# EasyEDA schematic SCH_XH-M401_8A_2022-11-25.json
TITLE: XH-M401; REV: 1.0; Date: Zibbi; Sheet: 1/1; Drawn By: Zibbi
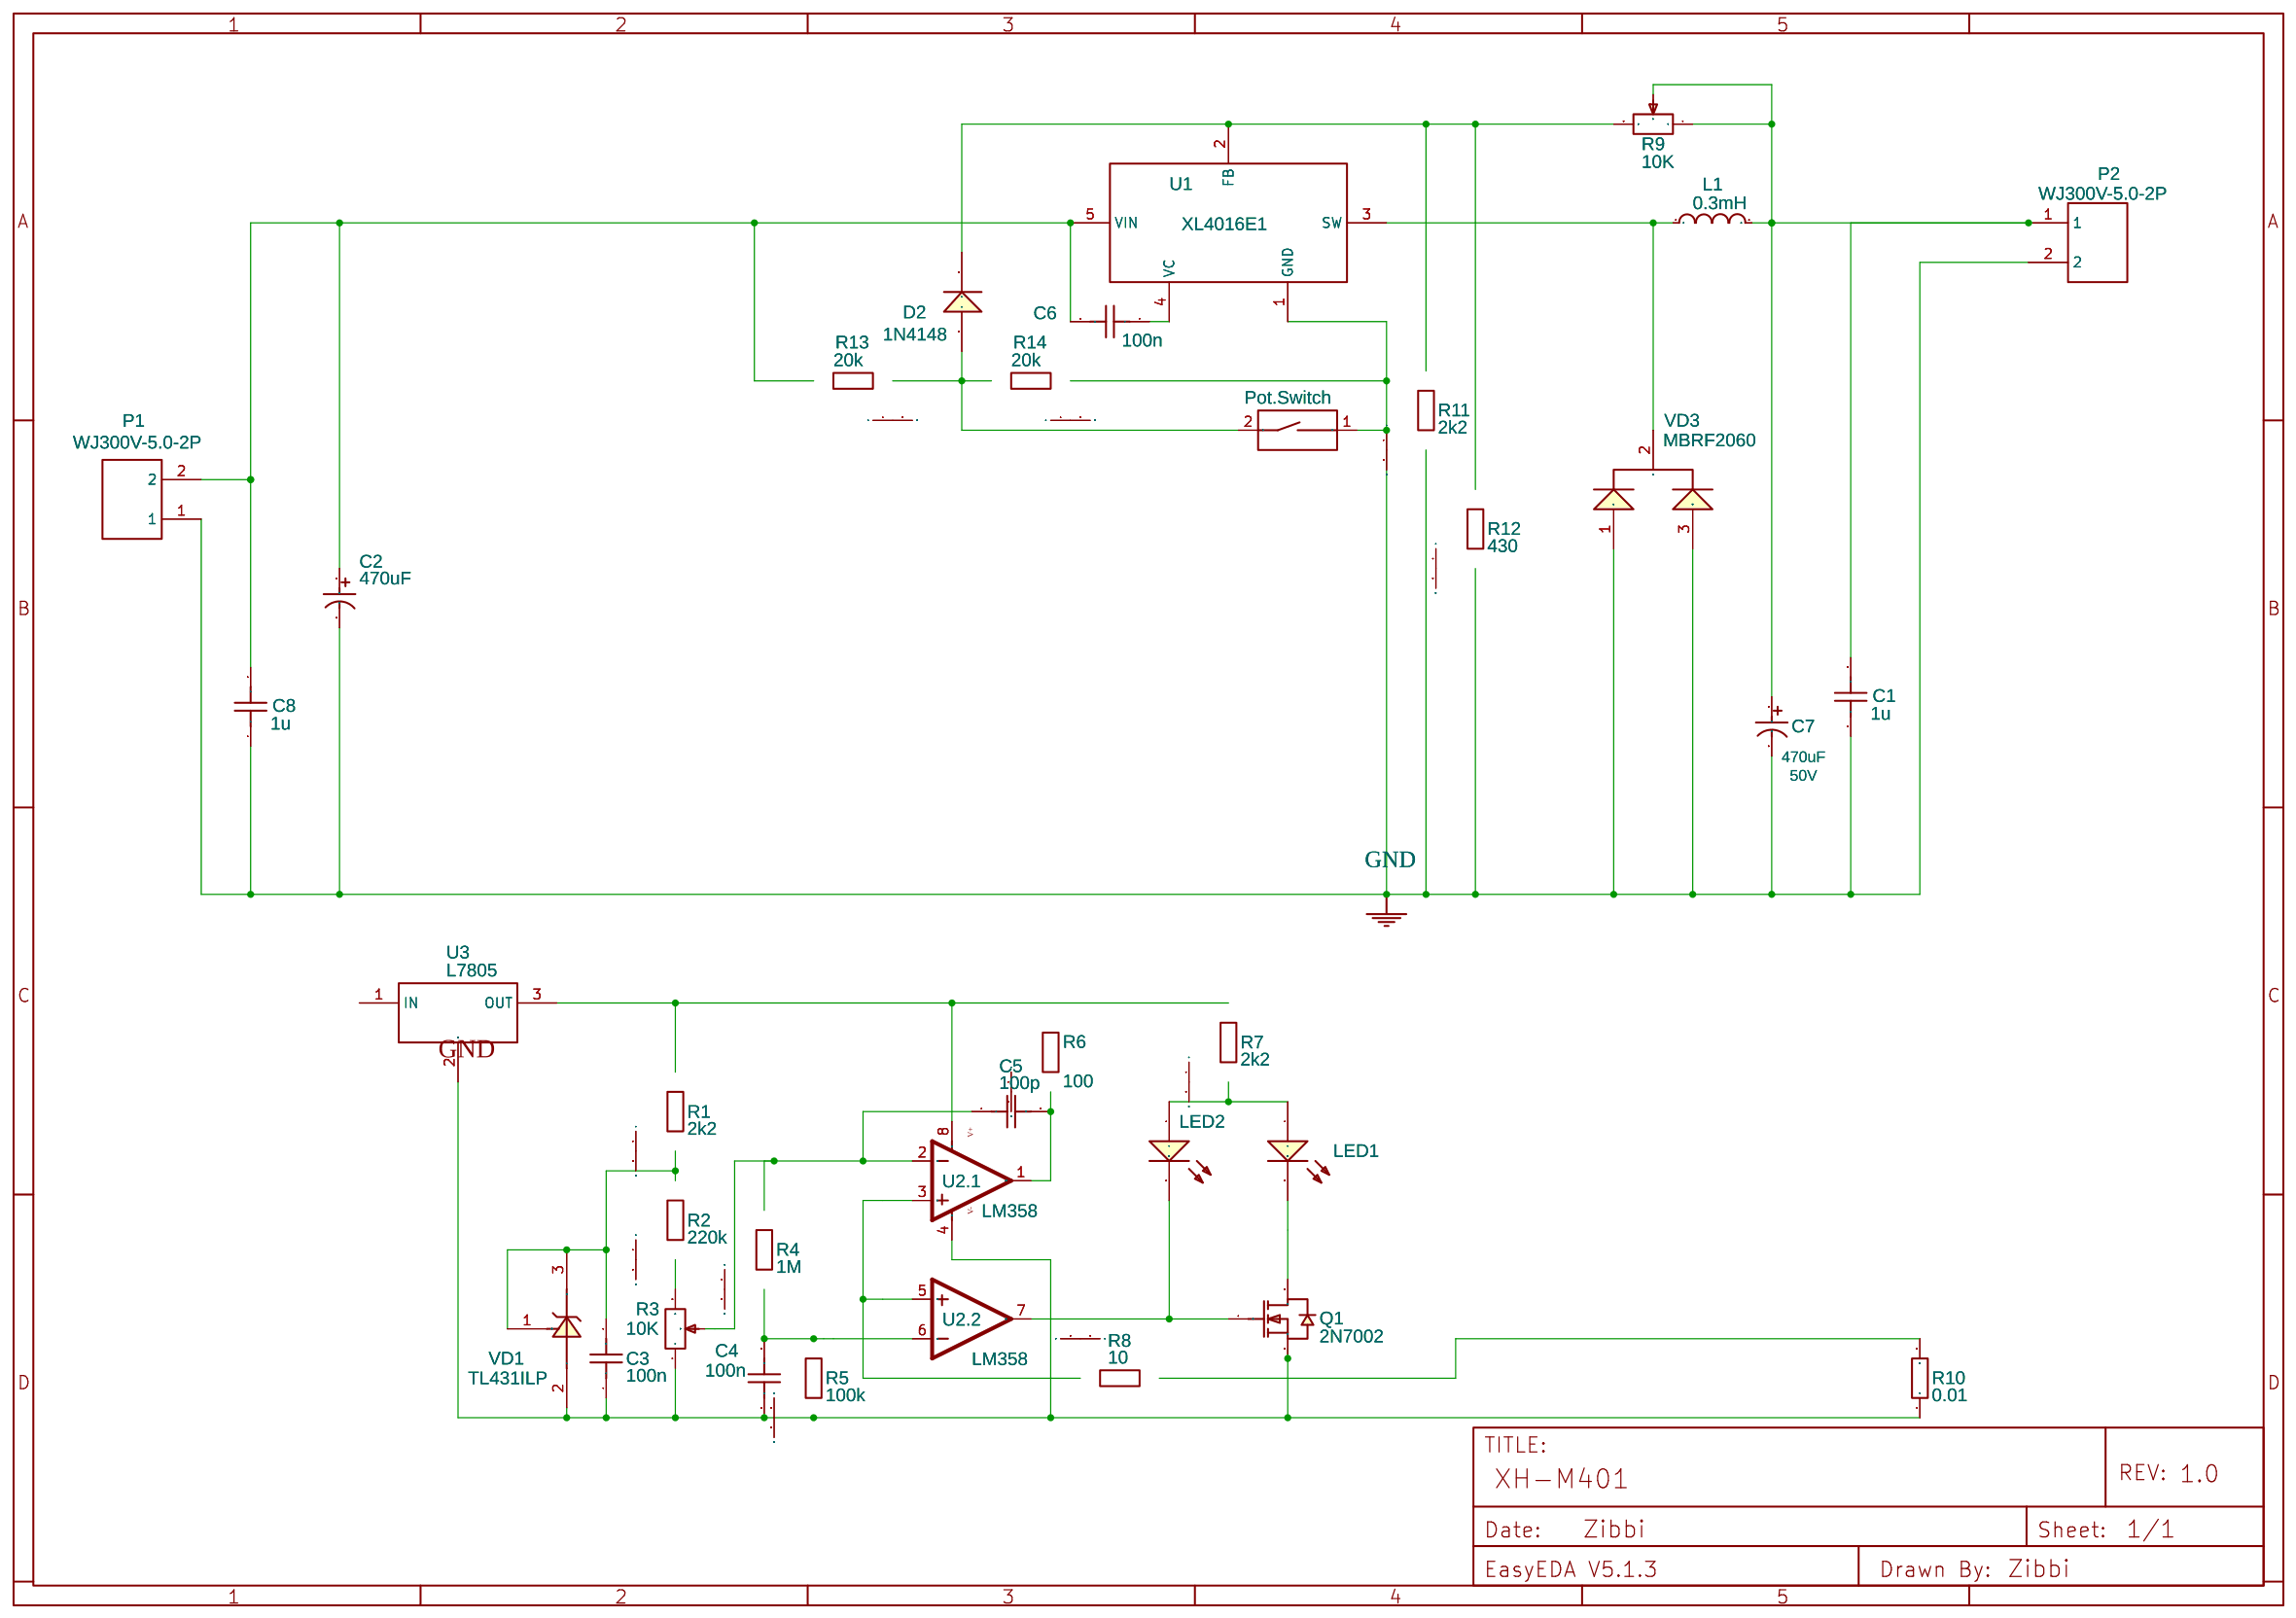
[diagram p0: schematic sheet]

## Parts
C1  1u  [RAD-0.1]
C2  470uF  [CAP-D10.0XF5.0]
C3  100n  [RAD-0.1]
C4  100n  [RAD-0.1]
C5  100p  [RAD-0.1]
C6  100n  [RAD-0.1]
C7  470uF\n50V  [CAP-D12.5XF5.0]
C8  1u  [RAD-0.1]
D2  1N4148  [DO-35]
L1  0.3mH  [AXIAL-0.4]
LED1  204-10UYC/S530-A3  [LED-3MM/2.54]
LED2  204-10UYC/S530-A3  [LED-3MM/2.54]
P1  WJ300V-5.0-2P  [WJ300V-5.00-2P]
P2  WJ300V-5.0-2P  [WJ300V-5.00-2P]
POT.SWITCH  Pot.Switch  [VDG/S-01L]
Q1  2N7002  [SOT-23(SOT-23-3)]
R1  2k2  [AXIAL-0.3]
R2  220k  [AXIAL-0.3]
R3  10K  [RES-ADJ_3362S]
R4  1M  [AXIAL-0.3]
R5  100k  [AXIAL-0.3]
R6  100  [AXIAL-0.3]
R7  2k2  [AXIAL-0.3]
R8  10  [AXIAL-0.3]
R9  10K  [RES-ADJ_3362S]
R10  0.01  [2512]
R11  2k2  [AXIAL-0.3]
R12  430  [AXIAL-0.3]
R13  20k  [AXIAL-0.3]
R14  20k  [AXIAL-0.3]
U1  XL4016E1  [TO-220-5 XL4016E1]
U2  LM358  [DIP08]  (sections 1,2)
U3  L7805  [TO-220(TO-220-3)]
VD1  TL431ILP  [TO-92(TO-92-3)]
VD3  MBRF2060  [ONSC-TO-220FP-3-221D-03]

## Library data of the parts
C1 C8 = Cap_RAD-0.1_US: Manufacturer Part: ?
C2 = -: Voltage: 50V; Supplier: LCSC; Manufacturer: CapXon; Manufacturer Part: KF471M050G200A; Supplier Part: C59355
C3-C6 = Capacitor: Manufacturer Part: ?
C7 = -: Voltage: 50V; Supplier: LCSC; Manufacturer: CapXon; Manufacturer Part: KF102M050I250A; Supplier Part: C59328
D2 = -: Supplier: LCSC; Manufacturer: ST; Supplier Part: C14516
L1 = Inductor: Manufacturer Part: ?
LED1 LED2 = -: Supplier: LCSC; Manufacturer: EVERLIGHT; Supplier Part: C73643
P1 P2 = -: Supplier: LCSC; Manufacturer: ReliaPro; image: //image.lceda.cn/szlcsc/C8385.jpg; Supplier Part: C8385
POT.SWITCH = -: Supplier: LCSC; Manufacturer: ReliaPro; Manufacturer Part: VDG/S-01L blue; image: //image.lceda.cn/szlcsc/C47086.jpg; Supplier Part: C47086; Package Display: No
Q1 = -: Supplier: LCSC; Manufacturer: CJ; LCSC Assembly: Yes; Supplier Part: C8545
R1 R2 R4-R8 R11-R14 = Resistor: Manufacturer Part: ?
R3 R9 = -: Supplier: LCSC; Manufacturer: BOURNS; Manufacturer Part: 3362S-1-103LF; Supplier Part: C81272
R10 = -: Power: 1W; Tolerance: ±1%; Supplier: LCSC; Manufacturer: UniOhm; Manufacturer Part: 25121WF180LT4F; Supplier Part: C48628
U1 = -: Supplier: LCSC; Manufacturer: XLSEMI; Supplier Part: C55881; Package Display: No
U2 = -: catid: 20; Contributor: SparkFun; Manufacturer Part: ?
U3 = -: catid: 20; Supplier: LCSC; Manufacturer: STMicroelectronics; Manufacturer Part: L7805ABV; Supplier Part: C16807
VD1 = -: Supplier: LCSC; Manufacturer: TI; Supplier Part: C113522
VD3 = -: SWITCHMODE(TM) Schottky Power Rectifier, 3-Pin TO-220FP, Tube; catid: 20; Manufacturer Part: ?

## Nets
GND: C1.1 C2.2 C7.2 C8.1 P1.1 P2.2 POT.SWITCH.1 R11.1 R12.1 R14.1 U1.1(GND) VD3.1(A1) VD3.3(A2)
Net-(C1-2): C1.2 C7.1 L1.2 P2.1 R9.1 R9.2
Net-(C2-1): C2.1 C6.2 C8.2 P1.2 R13.2 U1.5(VIN)
Net-(C3-1): C3.1 C4.1 Q1.2(S) R3.1 R5.1 R10.1 U2.4(V-) U3.2(GND) VD1.2(A)
Net-(C3-2): C3.2 R1.1 R2.2 VD1.1(REF) VD1.3(C)
Net-(C4-2): C4.2 R4.1 R5.2 U2.6(-IN)
Net-(C5-1): C5.1 R3.2 R4.2 U2.2(-IN)
Net-(C5-2): C5.2 R6.1 U2.1(OUT)
Net-(C6-1): C6.1 U1.4(VC)
Net-(D2-1): D2.1(A) POT.SWITCH.2 R13.1 R14.2
Net-(D2-2): D2.2(K) R9.3 R11.2 R12.2 U1.2(FB)
Net-(L1-1): L1.1 U1.3(SW) VD3.2(K)
Net-(LED1-1): LED1.1(A) LED2.1(A) R7.1
Net-(LED1-2): LED1.2(C) Q1.3(D)
Net-(LED2-2): LED2.2(C) Q1.1(G) U2.7(OUT)
Net-(R1-2): R1.2 R7.2 U2.8(V+) U3.3(OUT)
Net-(R2-1): R2.1 R3.3
Net-(R8-1): R8.1 U2.3(+IN) U2.5(+IN)
Net-(R8-2): R8.2 R10.2

Not connected (* = marked no-connect by the designer): R6 2; U3 1(IN)
